# Altium schematic sheet TruckCape BeagleBone Headers v4 - MITM.SchDoc: Beaglebone Black Truck Cape - MITM
size Letter; Author: Dr. Jeremy Daily; CompanyName: The University of Tulsa; Organization: Mechanical Engineering; Address1: The University of Tulsa; Address2: 800 S. Tucker Dr; Address3: Tulsa, OK 74104; DocumentNumber: Headers, J1708 CAN, Power; Revision: 4; SheetNumber: 1; SheetTotal: 2; ProjectName: NSF EAGER Testbed
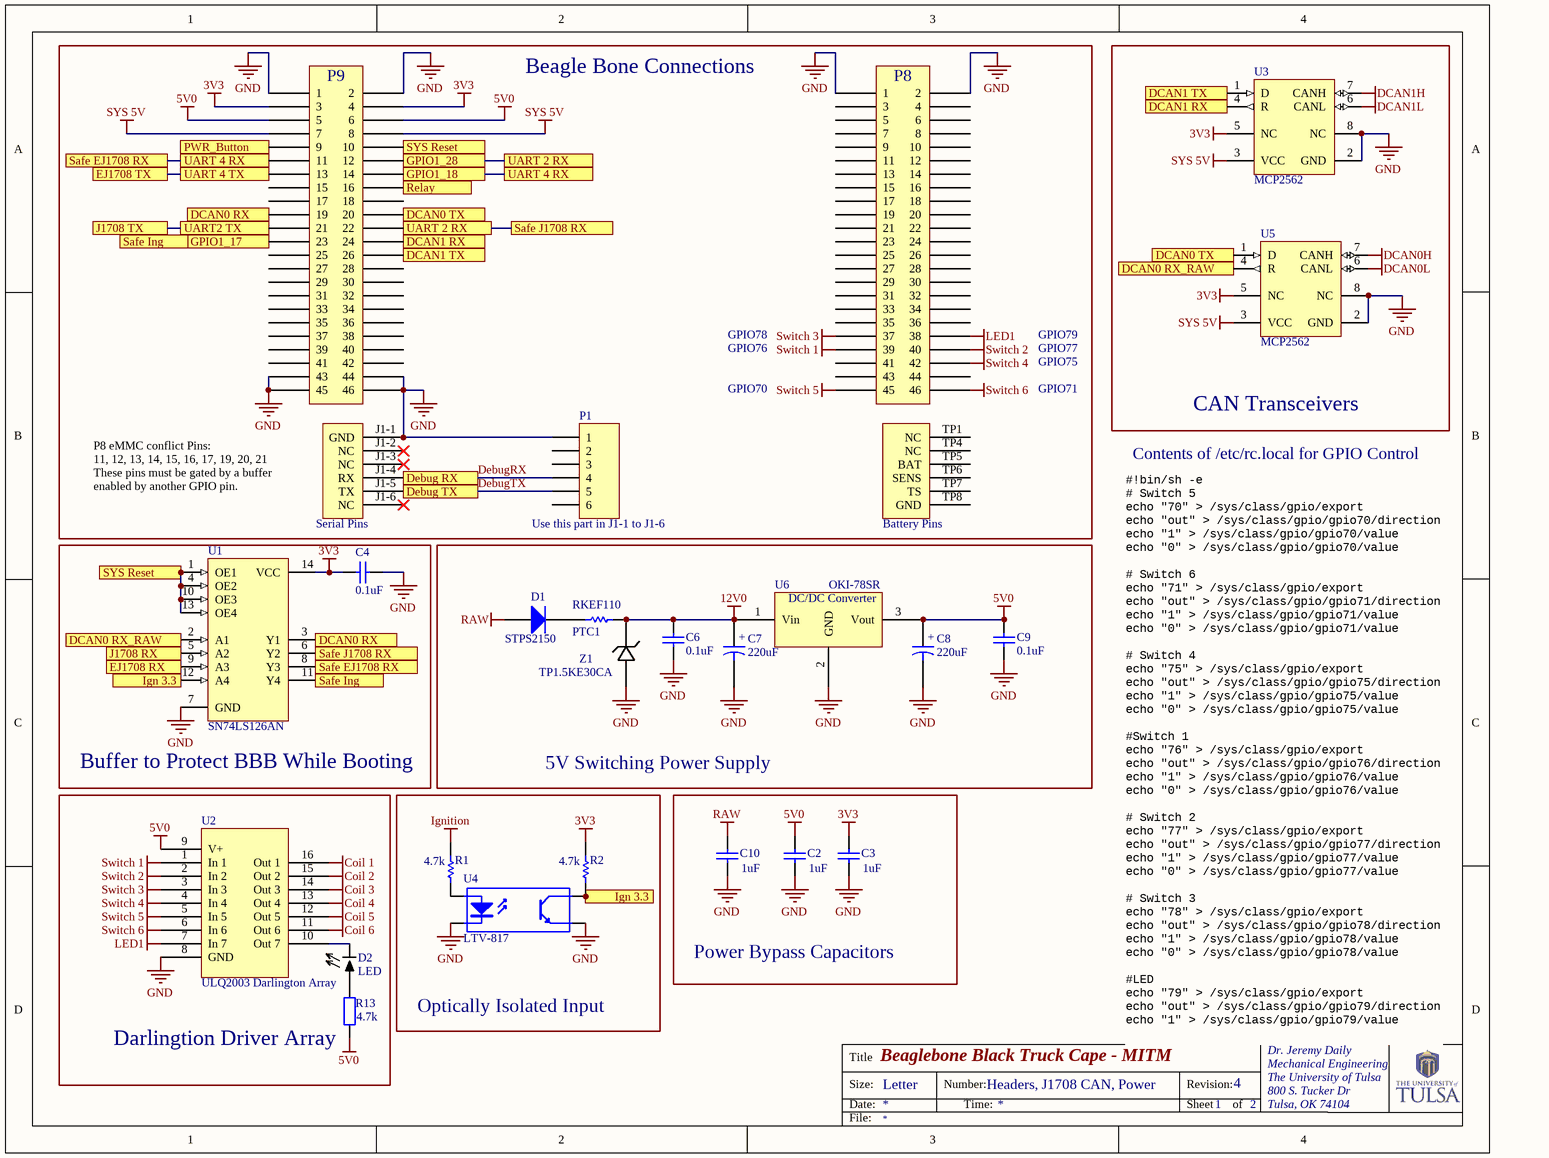
[diagram p0: TruckCape BeagleBone Headers v4 - MITM.SchDoc]

## Parts
BeagleBoneBlack1  BeagleBoneBlack  [Beagleboneblack]  (value not drawn)
C2  1uF  [CAPR5-4X5]
C3  1uF  [CAPR5-4X5]
C4  0.1uF  [CAPR5-4X5]
C6  0.1uF  [CAPR5-4X5]
C7  220uF  [Elec. Cap 5 x 10mm]
C8  220uF  [Elec. Cap 5 x 10mm]
C9  0.1uF  [CAPR5-4X5]
C10  1uF  [CAPR5-4X5]
D1  STPS2150  [DO-41]
D2  LED  [LED - 5mm Through Hole]
P1  Use this part in J1-1 to J1-6  [HDR1X6]
PTC1  RKEF110  [PTC]
R1  4.7k  [Axial-0.4]
R2  4.7k  [Axial-0.4]
R13  4.7k  [AXIAL-0.4]
U1  SN74LS126AN  [N14A]
U2  ULQ2003 Darlington Array  [DIP16]
U3  MCP2562  [DIP8]
U4  LTV-817  [DIP-4]
U5  MCP2562  [DIP8]
U6  OKI-78SR  [OKI-78SR]
Z1  TP1.5KE30CA  [DIODE-0.7]

## Blocks framed on the sheet
Beagle Bone Connections: BeagleBoneBlack1 P1
CAN Transceivers: U3 U5
Buffer to Protect BBB While Booting: C4 U1
5V Switching Power Supply: C6-C9 D1 PTC1 U6 Z1
Darlingtion Driver Array: D2 R13 U2
Optically Isolated Input: R1 R2 U4
Power Bypass Capacitors: C2 C3 C10

## Ports
DCAN0 RX, DCAN0 RX_RAW, DCAN0 TX, DCAN1 RX, DCAN1 TX, Debug RX, Debug TX, EJ1708 RX, EJ1708 TX, GPIO1_17, GPIO1_18, GPIO1_28, Ign 3.3, J1708 RX, J1708 TX, PWR_Button, Relay, Safe EJ1708 RX, Safe Ing, Safe J1708 RX, SYS Reset, UART2 TX, UART 2 RX, UART 4 RX, UART 4 TX

## Nets
3V3: BeagleBoneBlack1.3 BeagleBoneBlack1.4 C3.1 C4.1 R2.1 U1.14(VCC) U3.5(NC) U5.5(NC)
5V0: BeagleBoneBlack1.5 BeagleBoneBlack1.6 C2.1 C8.1 C9.2 R13.1 U2.9(V+) U6.3(Vout)
12V0: C6.2 C7.1 PTC1.2 U6.1(Vin) Z1.2(K)
Coil 1: U2.16(Out_1)
Coil 2: U2.15(Out_2)
Coil 3: U2.14(Out_3)
Coil 4: U2.13(Out_4)
Coil 5: U2.12(Out_5)
Coil 6: U2.11(Out_6)
DCAN0H: U5.7(CANH)
DCAN0L: U5.6(CANL)
DCAN1H: U3.7(CANH)
DCAN1L: U3.6(CANL)
GND: BeagleBoneBlack1.1 BeagleBoneBlack1.2 BeagleBoneBlack1.43 BeagleBoneBlack1.44 BeagleBoneBlack1.45 BeagleBoneBlack1.46 BeagleBoneBlack1.J1-1(GND) BeagleBoneBlack1.P1(1) BeagleBoneBlack1.P2(2) C2.2 C3.2 C4.2 C6.1 C7.2(-) C8.2(-) C9.1 C10.2 P1.1 U1.7(GND) U2.8(GND) U3.2(GND) U3.8(NC) U4.2(K) U4.3(E) U5.2(GND) U5.8(NC) U6.2(GND) Z1.1(A)
Ignition: R1.1
LED1: BeagleBoneBlack1.P38(38) U2.7(In_7)
RAW: C10.1 D1.1(A)
Switch 1: BeagleBoneBlack1.P39(39) U2.1(In_1)
Switch 2: BeagleBoneBlack1.P40(40) U2.2(In_2)
Switch 3: BeagleBoneBlack1.P37(37) U2.3(In_3)
Switch 4: BeagleBoneBlack1.P42(42) U2.4(In_4)
Switch 5: BeagleBoneBlack1.P45(45) U2.5(In_5)
Switch 6: BeagleBoneBlack1.P46(46) U2.6(In_6)
SYS 5V: BeagleBoneBlack1.7 BeagleBoneBlack1.8 U3.3(VCC) U5.3(VCC)
DCAN0 RX: BeagleBoneBlack1.19 U1.3(Y1) ; port DCAN0 RX
DCAN0 RX_RAW: U1.2(A1) U5.4(R) ; port DCAN0 RX_RAW
DCAN0 TX: BeagleBoneBlack1.20 U5.1(D) ; port DCAN0 TX
DCAN1 RX: BeagleBoneBlack1.24 U3.4(R) ; port DCAN1 RX
DCAN1 TX: BeagleBoneBlack1.26 U3.1(D) ; port DCAN1 TX
DebugRX: BeagleBoneBlack1.J1-4(RX) P1.4 ; port Debug RX
DebugTX: BeagleBoneBlack1.J1-5(TX) P1.5 ; port Debug TX
EJ1708 RX: U1.9(A3) ; port EJ1708 RX
EJ1708 TX: BeagleBoneBlack1.13 ; port UART 4 TX, port EJ1708 TX
GPIO1_17: BeagleBoneBlack1.23 U1.11(Y4) ; port GPIO1_17, port Safe Ing
GPIO1_18: BeagleBoneBlack1.11 BeagleBoneBlack1.14 U1.8(Y3) ; port UART 4 RX, port GPIO1_18, port Safe EJ1708 RX
GPIO1_28: BeagleBoneBlack1.12 BeagleBoneBlack1.22 U1.6(Y2) ; port GPIO1_28, port UART 2 RX, port Safe J1708 RX
Ign 3.3: R2.2 U1.12(A4) U4.4(C) ; port Ign 3.3
J1708 RX: U1.5(A2) ; port J1708 RX
J1708 TX: BeagleBoneBlack1.21 ; port UART2 TX, port J1708 TX
PWR_Button: BeagleBoneBlack1.9 ; port PWR_Button
Relay: BeagleBoneBlack1.16 ; port Relay
SYS Reset: BeagleBoneBlack1.10 U1.1(OE1) U1.4(OE2) U1.10(OE3) U1.13(OE4) ; port SYS Reset
NetD1_2: D1.2(K) PTC1.1
NetD2_1: D2.1(A) R13.2
NetD2_2: D2.2(C) U2.10(Out_7)
NetR1_2: R1.2 U4.1(A)

Not connected (* = marked no-connect by the designer): BeagleBoneBlack1 15 17 18 25 27 28 29 30 31 32 33 34 35 36 37 38 39 40 41 42 J1-2(NC)* J1-3(NC)* J1-6(NC)* P3(3) P4(4) P5(5) P6(6) P7(7) P8(8) P9(9) P10(10) P11(11) P12(12) P13(13) P14(14) P15(15) P16(16) P17(17) P18(18) P19(19) P20(20) P21(21) P22(22) P23(23) P24(24) P25(25) P26(26) P27(27) P28(28) P29(29) P30(30) P31(31) P32(32) P33(33) P34(34) P35(35) P36(36) P41(41) P43(43) P44(44) TP1(NC) TP4(NC) TP5(BAT) TP6(SENS) TP7(TS) TP8(GND); P1 2 3 6

## Notes on the sheet
- (near BeagleBoneBlack1) GPIO76
- (near BeagleBoneBlack1) GPIO78
- GPIO75
- GPIO77
- GPIO79
- (near BeagleBoneBlack1) GPIO70
- GPIO71
- (near BeagleBoneBlack1) P8 eMMC conflict Pins:
  11, 12, 13, 14, 15, 16, 17, 19, 20, 21
  These pins must be gated by a buffer enabled by another GPIO pin.
- Contents of /etc/rc.local for GPIO Control
- #!bin/sh -e
  # Switch 5
  echo "70" > /sys/class/gpio/export
  echo "out" > /sys/class/gpio/gpio70/direction
  echo "1" > /sys/class/gpio/gpio70/value
  echo "0" > /sys/class/gpio/gpio70/value
  # Switch 6
  echo "71" > /sys/class/gpio/export
  echo "out" > /sys/class/gpio/gpio71/direction
  echo "1" > /sys/class/gpio/gpio71/value
  echo "0" > /sys/class/gpio/gpio71/value
  # Switch 4
  echo "75" > /sys/class/gpio/export
  echo "out" > /sys/class/gpio/gpio75/direction
  echo "1" > /sys/class/gpio/gpio75/value
  echo "0" > /sys/class/gpio/gpio75/value
  #Switch 1
  echo "76" > /sys/class/gpio/export
  echo "out" > /sys/class/gpio/gpio76/direction
  echo "1" > /sys/class/gpio/gpio76/value
  echo "0" > /sys/class/gpio/gpio76/value
  # Switch 2
  echo "77" > /sys/class/gpio/export
  echo "out" > /sys/class/gpio/gpio77/direction
  echo "1" > /sys/class/gpio/gpio77/value
  echo "0" > /sys/class/gpio/gpio77/value
  # Switch 3
  echo "78" > /sys/class/gpio/export
  echo "out" > /sys/class/gpio/gpio78/direction
  echo "1" > /sys/class/gpio/gpio78/value
  echo "0" > /sys/class/gpio/gpio78/value
  #LED
  echo "79" > /sys/class/gpio/export
  echo "out" > /sys/class/gpio/gpio79/direction
  echo "1" > /sys/class/gpio/gpio79/value
- Title
- Size:
- Date:
- Letter
- Number:
- Time:
- Revision:
- Sheet
- of
- File:
- (in symbol 7805) DC/DC Converter
- (in symbol BeagleBoneBlack) Serial Pins; Battery Pins
- (in symbol Electrolytic Cap) +

## Library data of the parts
BeagleBoneBlack1 = BeagleBoneBlack: 46 Positions Header, Breakaway Connector 0.100" (2.54mm) Through Hole Tin; Manufacturer: Sullins Connector Solutions; PartNumber: PREC023DAAN-RC; Supplier 1: Digi-Key; Supplier Part Number 1: S2012EC-23-ND
C2 C3 C10 = Cap: CAP CER 1UF 100V X7R RADIAL; Manufacturer: Murata Electronics North America; PartNumber: RDER72A105K2M1H03A; Supplier 1: Digi-Key; Supplier Part Number 1: 490-9198-1-ND
C4 C6 C9 = Cap: CAP CER 0.1UF 100V X7R RADIAL; Manufacturer: Vishay BC Components; PartNumber: K104K20X7RH53H5; Supplier 1: Digi-Key; Supplier Part Number 1: BC5139-ND
C7 C8 = Electrolytic Cap: 220µF 50V Aluminum Electrolytic Capacitors Radial, Can 175 mOhm @ 10kHz 5000 Hrs @ 105°C; Manufacturer: EPCOS (TDK); PartNumber: B41858C6227M000; Supplier 1: Digi-Key; Supplier Part Number 1: 495-6000-ND
D1 = Diode 1N4003: Diode Schottky 150V 2A Through Hole DO-15; Manufacturer: STMicroelectronics; PartNumber: STPS2150; Supplier 1: Digi-Key; Supplier Part Number 1: 497-3213-1-ND
D2 = LED: Green 569nm LED Indication - Discrete 2.1V Radial; Manufacturer: Lite-On Inc.; PartNumber: LTL-4233; Supplier 1: Digi-Key; Supplier Part Number 1: 160-1130-ND
P1 = Header 6: CONN HEADER FEMALE 6POS .1" GOLD; Manufacturer: Sullins Connector Solutions; PartNumber: PPPC061LFBN-RC; Supplier 1: Digi-Key; Supplier Part Number 1: S7039-ND
PTC1 = SMD Resistor: Polymeric PTC Resettable Fuse 60V 1.1A Ih Through Hole Radial, Disc; Manufacturer: Littelfuse Inc.; Supplier 1: Digi-Key; PartNumber: RKEF110; Supplier Part Number 1: RKEF110HF-ND
R1 R2 = Chip Resistor: RES SMD 4.7K OHM 1% 1/10W 0603; Manufacturer: Yageo; PartNumber: CFR-25JB-52-4K7; Supplier 1: Digi-Key; Supplier Part Number 1: 4.7KQBK-ND
R13 = Res2: RES SMD 4.7K OHM 1% 1/10W 0603; Manufacturer: Yageo; PartNumber: CFR-25JB-52-4K7; Published: 8-Jun-2000; LatestRevisionDate: 17-Jul-2002; LatestRevisionNote: Re-released for DXP Platform.; PackageReference: AXIAL-0.4; Publisher: Altium Limited; PackageDescription: Axial Device, Thru-Hole; 2 Leads; 0.4 in Pin Spacing; Value: 4.7k; Supplier 1: Digi-Key; Supplier Part Number 1: 4.7KQBK-ND
U1 = DM74LS126AN: Quad 3-State Buffer; Manufacturer: Texas Instruments; Published: 17-Jul-2002; LatestRevisionDate: 29-May-2009; LatestRevisionNote: Component Body Added.; DatasheetVersion: Mar-1998; PackageVersion: 2000; PackageReference: N14A; Publisher: Altium Limited; PackageDescription: DIP, 14-Pin, Row Spacing 7.62 mm, Pitch 2.54 mm; ComponentLink1Description: Manufacturer Link; ComponentLink1URL: http://www.fairchildsemi.com/; PartNumber: SN74LS126AN; Supplier 1: Digi-Key; Supplier Part Number 1: 296-3643-5-ND
U2 = ULQ2003: High voltage, high current Darlington arrays each containing seven open collector Darlington pairswith common emitters.; Manufacturer: Texas Instruments; PartNumber: ULQ2003AN; Supplier 1: Digi-Key; Supplier Part Number 1: 296-22623-5-ND
U3 U5 = SN65HVD232DR: 1/1 Transceiver Half CAN 8-PDIP; Manufacturer: Microchip Technology; PartNumber: MCP2562-E/P; Eco-Plan: Green (RoHS & no Sb/Br); Drivers Per Package: 1; Isolated: No; Transient Pulse Protection(V): -25 to 25; ICC(Max)(mA): 17; Supply Voltage(s)(V): 3.3; Rating: Catalog; DatasheetVersion: SLOS346K; PackageVersion: revM, Jun-2011; PackageReference: D8; PackageDescription: 8-Pin Plastic Small Outline Integrated Circuit, 4.9 x 3.9 mm, Pitch 1.27 mm Pitch; Supplier 1: Digi-Key; Supplier Part Number 1: MCP2562-E/P-ND; Supplier 2: Digi-Key; Supplier Part Number 2: 296-26344-1-ND; Supplier 3: Digi-Key; Supplier Part Number 3: 296-26344-6-ND; Supplier 4: Newark; Supplier Part Number 4: 75C7753; Supplier 5: Mouser; Supplier Part Number 5: 595-SN65HVD232DR; SubFamily: CAN; Receivers Per Package: 1; Footprint: SN65HVD232; Mounting Technology: Surface Mount; Code_JEDEC: MS-012AA; ComponentLink1Description: Datasheet; ComponentLink1URL: http://www.ti.com/general/docs/lit/getliterature.tsp?genericPartNumber=SN65HVD232&fileType=pdf
U4 = Optoisolator1: Optoisolator Transistor Output 5000Vrms 1 Channel 4-DIP; Manufacturer: Lite-On Inc.; Published: 24-Mar-1999; LatestRevisionDate: 04-Mar-2005; LatestRevisionNote: Sch pins 3 & 4 Swapped.; DatasheetVersion: Nov-2003; PackageReference: DIP-4; Publisher: Altium Limited; PartNumber: LTV-817; Supplier 1: Digi-Key; Supplier Part Number 1: 160-1366-5-ND
U6 = 7805: 5V DC/DC Converter (7805 replacement); Manufacturer: Murata Power Solutions Inc.; PartNumber: OKI-78SR-5/1.5-W36H-C; Supplier 1: Digi-Key; Supplier 2: Digi-Key; Supplier Part Number 1: 811-2692-ND; Supplier Part Number 2: 811-2692-ND
Z1 = Zener: TVS DIODE 25.6V 41.4V DO201; Manufacturer: Littelfuse Inc.; Supplier 1: Digi-Key; Supplier Part Number 1: F7610CT-ND; PartNumber: TP1.5KE30CA